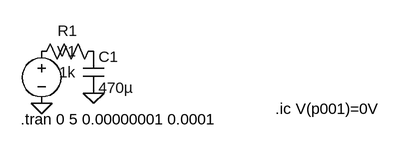
[diagram p0: schematic 353PWMsimulation.asc]
353PWMsimulation.asc, the LTspice schematic file:
Version 4
SHEET 1 912 680
FLAG 288 272 0
FLAG 208 288 0
SYMBOL res 304 192 R90
WINDOW 0 0 56 VBottom 2
WINDOW 3 32 56 VTop 2
SYMATTR InstName R1
SYMATTR Value 1k
SYMBOL cap 272 208 R0
SYMATTR InstName C1
SYMATTR Value 470µ
SYMBOL voltage 208 192 R0
WINDOW 123 0 0 Left 0
WINDOW 39 0 0 Left 0
WINDOW 3 24 96 Invisible 2
SYMATTR InstName V1
SYMATTR Value PULSE(0 5 0 0.000001 0.000001 0.0015 0.002 2000000)
TEXT 176 312 Left 2 !.tran 0 5 0.00000001 0.0001
TEXT 568 296 Left 2 !.ic V(p001)=0V

The netlist it stands for:
* 353PWMsimulation.asc
R1 P001 P002 1k
C1 P001 0 470µ
V1 P002 0 PULSE(0 5 0 0.000001 0.000001 0.0015 0.002 2000000)
.tran 0 5 0.00000001 0.0001
.ic V(p001)=0V
.backanno
.end